# Altium schematic sheet Loads.SchDoc: DaughterBoard Tester
size Letter; DrawnBy: MTAN; Organization: Altium Limited; DocumentNumber: 6; Revision: A; SheetNumber: 6; SheetTotal: 6
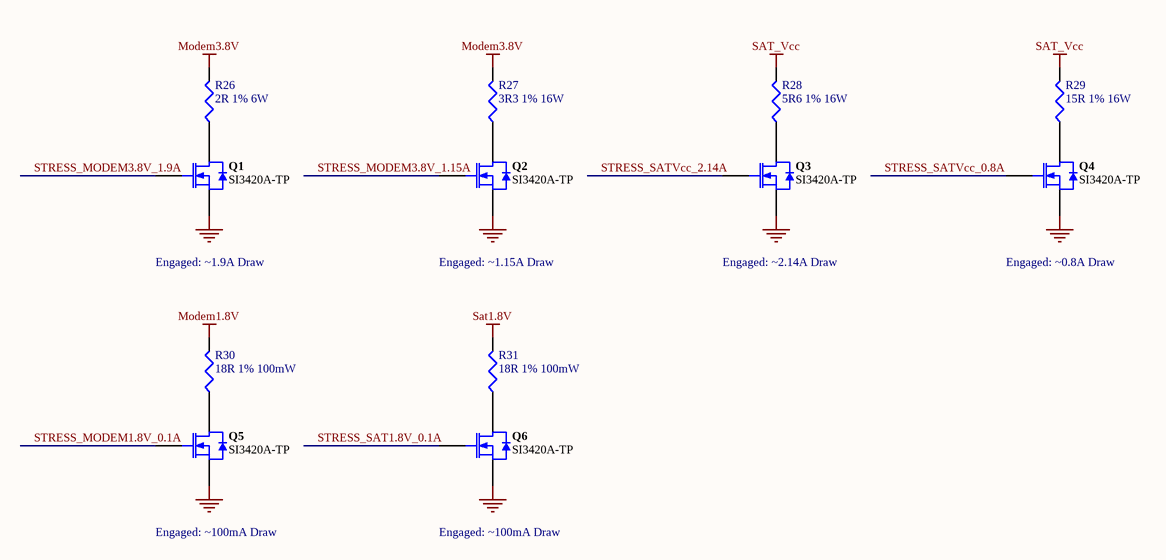
[diagram p0: Loads.SchDoc]

## Parts
Q1  SI3420A-TP  [INF-PG-SOT23_L]
Q2  SI3420A-TP  [INF-PG-SOT23_L]
Q3  SI3420A-TP  [INF-PG-SOT23_L]
Q4  SI3420A-TP  [INF-PG-SOT23_L]
Q5  SI3420A-TP  [INF-PG-SOT23_L]
Q6  SI3420A-TP  [INF-PG-SOT23_L]
R26  2R 1% 6W  [RESC6432AL]
R27  3R3 1% 16W  [RESC6432AL]
R28  5R6 1% 16W  [RESC6432AL]
R29  15R 1% 16W  [RESC6432AL]
R30  18R 1% 100mW  [J1-0603]
R31  18R 1% 100mW  [J1-0603]

## Nets
GND: Q1.2(SOURCE) Q2.2(SOURCE) Q3.2(SOURCE) Q4.2(SOURCE) Q5.2(SOURCE) Q6.2(SOURCE)
Modem1.8V: R30.2
Modem3.8V: R26.2 R27.2
Sat1.8V: R31.2
SAT_Vcc: R28.2 R29.2
STRESS_MODEM1.8V_0.1A: Q5.1(GATE)
STRESS_MODEM3.8V_1.9A: Q1.1(GATE)
STRESS_MODEM3.8V_1.15A: Q2.1(GATE)
STRESS_SAT1.8V_0.1A: Q6.1(GATE)
STRESS_SATVcc_0.8A: Q4.1(GATE)
STRESS_SATVcc_2.14A: Q3.1(GATE)
NetQ1_3: Q1.3(DRAIN) R26.1
NetQ2_3: Q2.3(DRAIN) R27.1
NetQ3_3: Q3.3(DRAIN) R28.1
NetQ4_3: Q4.3(DRAIN) R29.1
NetQ5_3: Q5.3(DRAIN) R30.1
NetQ6_3: Q6.3(DRAIN) R31.1

## Notes on the sheet
- Engaged: ~1.9A Draw
- Engaged: ~1.15A Draw
- Engaged: ~2.14A Draw
- Engaged: ~0.8A Draw
- Engaged: ~100mA Draw
- Title
- Drawn By:
- Date:
- Time:
- Revision:
- Sheet
- of
- The Latium Group of Companies
- 1312 10 Street
- Nisku, Alberta
- T9E 8K2
- Canada
- File:

## Library data of the parts
Q1-Q6 = 2N7002: MOSFET N-CH 20V 6A SOT-23; Manufacturer: Micro Commercial Co; Manufacturer Part Number: SI3420A-TP; Value: SI3420A-TP; Supplier 1: Digi-Key; Supplier 1 Part Number: SI3420A-TPMSCT-ND
R26 = Res3: RES SMD 2 OHM 1% 6W 2512; Manufacturer: Vishay Thin Film; Manufacturer Part Number: PCNM2512K2R00FST5; Value: 2R 1% 6W; Supplier 1: Digi-Key; Supplier 1 Part Number: 764-1271-1-ND
R27 = Res3: RES SMD 3.3 OHM 1% 16W 2512; Manufacturer: Susumu; Manufacturer Part Number: CPA2512Q3R30FS-T10; Value: 3R3 1% 16W; Supplier 1: Digi-Key; Supplier 1 Part Number: CPA25Q3.3CT-ND
R28 = Res3: RES SMD 5.6 OHM 1% 16W 2512; Manufacturer: Susumu; Manufacturer Part Number: CPA2512Q5R60FS-T10; Value: 5R6 1% 16W; Supplier 1: Digi-Key; Supplier 1 Part Number: CPA25Q5.6CT-ND
R29 = Res3: RES SMD 15 OHM 1% 16W 2512; Manufacturer: Susumu; Manufacturer Part Number: CPA2512Q15R0FS-T10; Value: 15R 1% 16W; Supplier 1: Digi-Key; Supplier 1 Part Number: CPA25Q15.0CT-ND
R30 R31 = Res3: Resistor; Value: 18R 1% 100mW